# EAGLE design fet_iac (EAGLE 6.4)
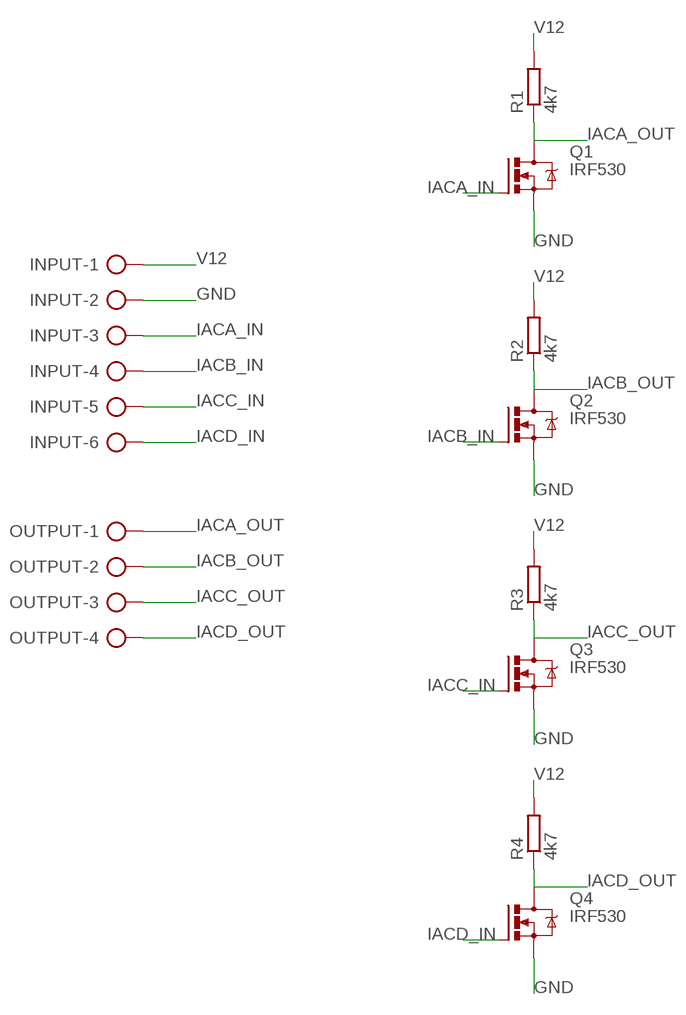
[diagram p0: schematic, sheet 1]

## Parts
INPUT  AK500/6  [AK500/6]
OUTPUT  AK500/4  [AK500/4]
Q1  IRF530  [TO220BV]
Q2  IRF530  [TO220BV]
Q3  IRF530  [TO220BV]
Q4  IRF530  [TO220BV]
R1  4k7  R-EU_0204/7  [0204/7]
R2  4k7  R-EU_0204/7  [0204/7]
R3  4k7  R-EU_0204/7  [0204/7]
R4  4k7  R-EU_0204/7  [0204/7]

## Nets
GND: INPUT.2 Q1.S Q2.S Q3.S Q4.S
IACA_IN: INPUT.3 Q1.G
IACA_OUT: OUTPUT.1 Q1.D R1.1
IACB_IN: INPUT.4 Q2.G
IACB_OUT: OUTPUT.2 Q2.D R2.1
IACC_IN: INPUT.5 Q3.G
IACC_OUT: OUTPUT.3 Q3.D R3.1
IACD_IN: INPUT.6 Q4.G
IACD_OUT: OUTPUT.4 Q4.D R4.1
V12: INPUT.1 R1.2 R2.2 R3.2 R4.2

## Library data of the parts
INPUT = con-ptr500:AK500/6: CONNECTOR; OC_FARNELL: unknown; OC_NEWARK: unknown
OUTPUT = con-ptr500:AK500/4: CONNECTOR; OC_FARNELL: unknown; OC_NEWARK: unknown
Q1-Q4 = transistor-power:IRF530: HEXFET Power MOSFET
R1-R4 = resistor:R-EU_: RESISTOR, European symbol

## Board
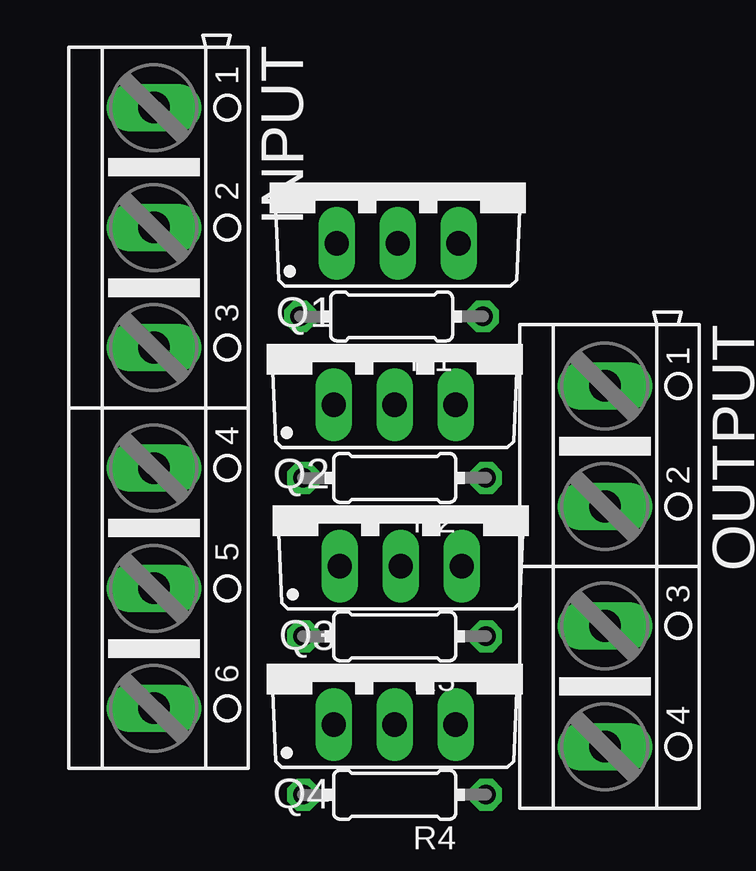
[diagram p1: board, top side]
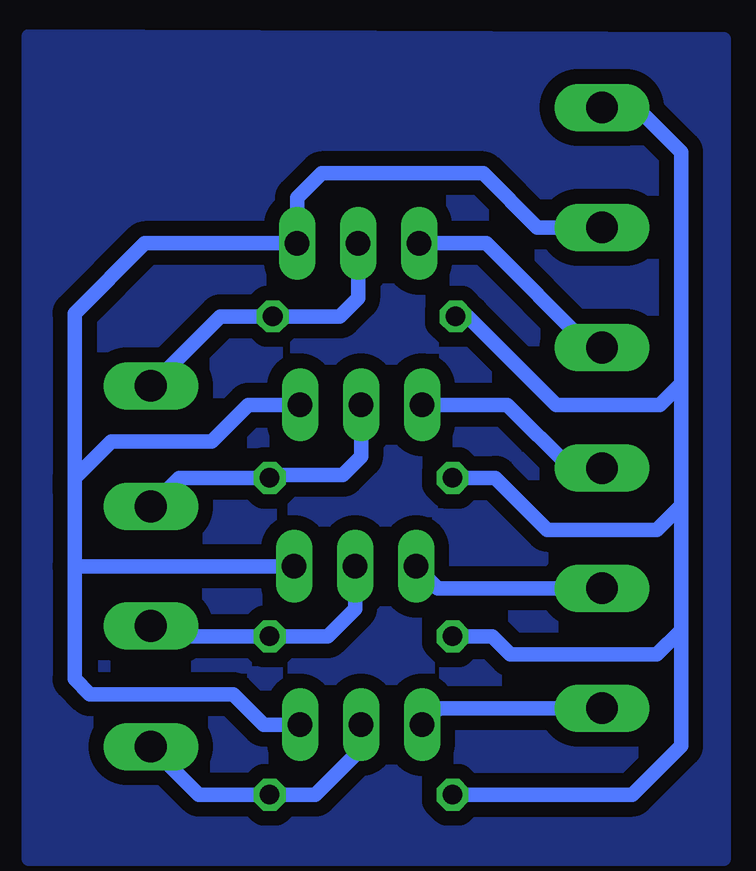
[diagram p2: board, bottom side, seen from below]

No outline drawn. Coordinates in mm, seen from the top.
Copper layers (1*16): Top 0.035mm / dielectric 1.5mm / Bottom 0.035mm
Design rules "default": minimum track width 10mil, minimum drill 24mil, track to track 8mil, track to pad 8mil, pad to pad 8mil, via to via 8mil, smd to smd 8mil, copper to edge 40mil, drill to drill 8mil, minimum pad ring 10mil, minimum via ring 8mil, stop-mask expansion 4mil, vias tented up to drill 0mil, thermal gap 10mil

### Footprints (pad centres in the part's own frame; a part is rotated, then mirrored left to right if it is on the bottom)
AK500/6 = drill 1.321 long: 1 -12.522,0; 2 -7.518,0; 3 -2.515,0; 4 2.515,0; 5 7.518,0; 6 12.522,0
AK500/4 = drill 1.321 long: 1 -7.518,0; 2 -2.489,0; 3 2.489,0; 4 7.518,0
TO220BV = drill 1.016 long: D 0,-2.54; G -2.54,-2.54; S 2.54,-2.54
0204/7 = drill 0.813 octagon: 1 -3.81,0; 2 3.81,0

### Placement (x,y rotation side)
INPUT  24.26,48.13 270 top
OUTPUT  43.05,41.53 270 top
Q1  34.42,57.53 0 top
Q2  34.29,50.8 0 top
Q3  34.54,44.07 0 top
Q4  34.29,37.47 0 top
R1  34.16,51.94 180 top
R2  34.29,45.21 180 top
R3  34.29,38.61 180 top
R4  34.29,32 180 top

### Tracks (layer width: path | path; a pad name or v marks a point on that pad's centre or on a via)
GND
  Bottom 0.61: INPUT.2 26.95,55.65 29.21,57.91 35.94,57.91 36.96,56.9 Q1.S 43.31,54.99 46.23,52.07 46.23,45.21 | Q2.S 38.99,48.26 40.51,46.74 44.7,46.74 46.23,45.21 | 46.23,45.21 46.23,44.7 46.23,41.53 | 46.23,41.53 46.23,36.83 45.59,36.2 39.62,36.2 38.35,34.92 Q4.S | Q3.S 46.23,41.53
IACA_IN
  Bottom 0.61: INPUT.3 24.74,50.65 29.08,54.99 Q1.G
IACA_OUT
  Bottom 0.61: Q1.D 34.42,52.7 35.18,51.94 R1.1 40.16,51.94 OUTPUT.1
IACB_IN
  Bottom 0.61: INPUT.4 25.55,45.62 28.19,48.26 Q2.G
IACB_OUT
  Bottom 0.61: Q2.D 34.29,46.1 35.05,45.34 37.97,45.34 R2.1 41.86,45.21 OUTPUT.2
IACC_IN
  Bottom 0.61: INPUT.5 31.09,40.62 Q3.G
IACC_OUT
  Bottom 0.61: Q3.D 34.54,39.75 35.69,38.61 R3.1 42.62,38.61 OUTPUT.3
IACD_IN
  Bottom 0.61: INPUT.6 31.06,35.61 Q4.G
IACD_OUT
  Bottom 0.61: Q4.D 34.29,33.91 36.2,32 R4.1 41.05,32 OUTPUT.4
N$1
  pour Bottom (isolate 0.61): 19.18,63.5 48.13,63.63 48.13,29.34 19.18,29.34
V12
  Bottom 0.61: R1.2 29.84,51.94 26.16,48.26 21.84,48.26 20.95,49.15 | 20.95,49.15 20.95,58.8 22.86,60.71 24.21,60.71 INPUT.1 | R2.2 28.7,45.21 26.54,43.05 21.97,43.05 20.95,44.07 | 20.95,44.07 20.95,49.15 | R3.2 28.83,38.61 28.07,37.85 21.97,37.85 20.95,38.86 | 20.95,38.86 20.95,39.24 20.95,44.07 | R4.2 22.99,32 20.95,34.04 20.95,38.86